# EasyEDA Pro project ProProject_Tautek_nRF5340_2024-01-15.epro

# Schematic Schematic1
Create Date: 2023-10-27; Page Name: P1; Project Name: Tautek_nRF5340; Schematic Name: Schematic1; Update Date: 2023-12-15; Drawed: Stephen Long Jr; Page Size: A4; Part Number: XIAO833_001; Version: V1.0
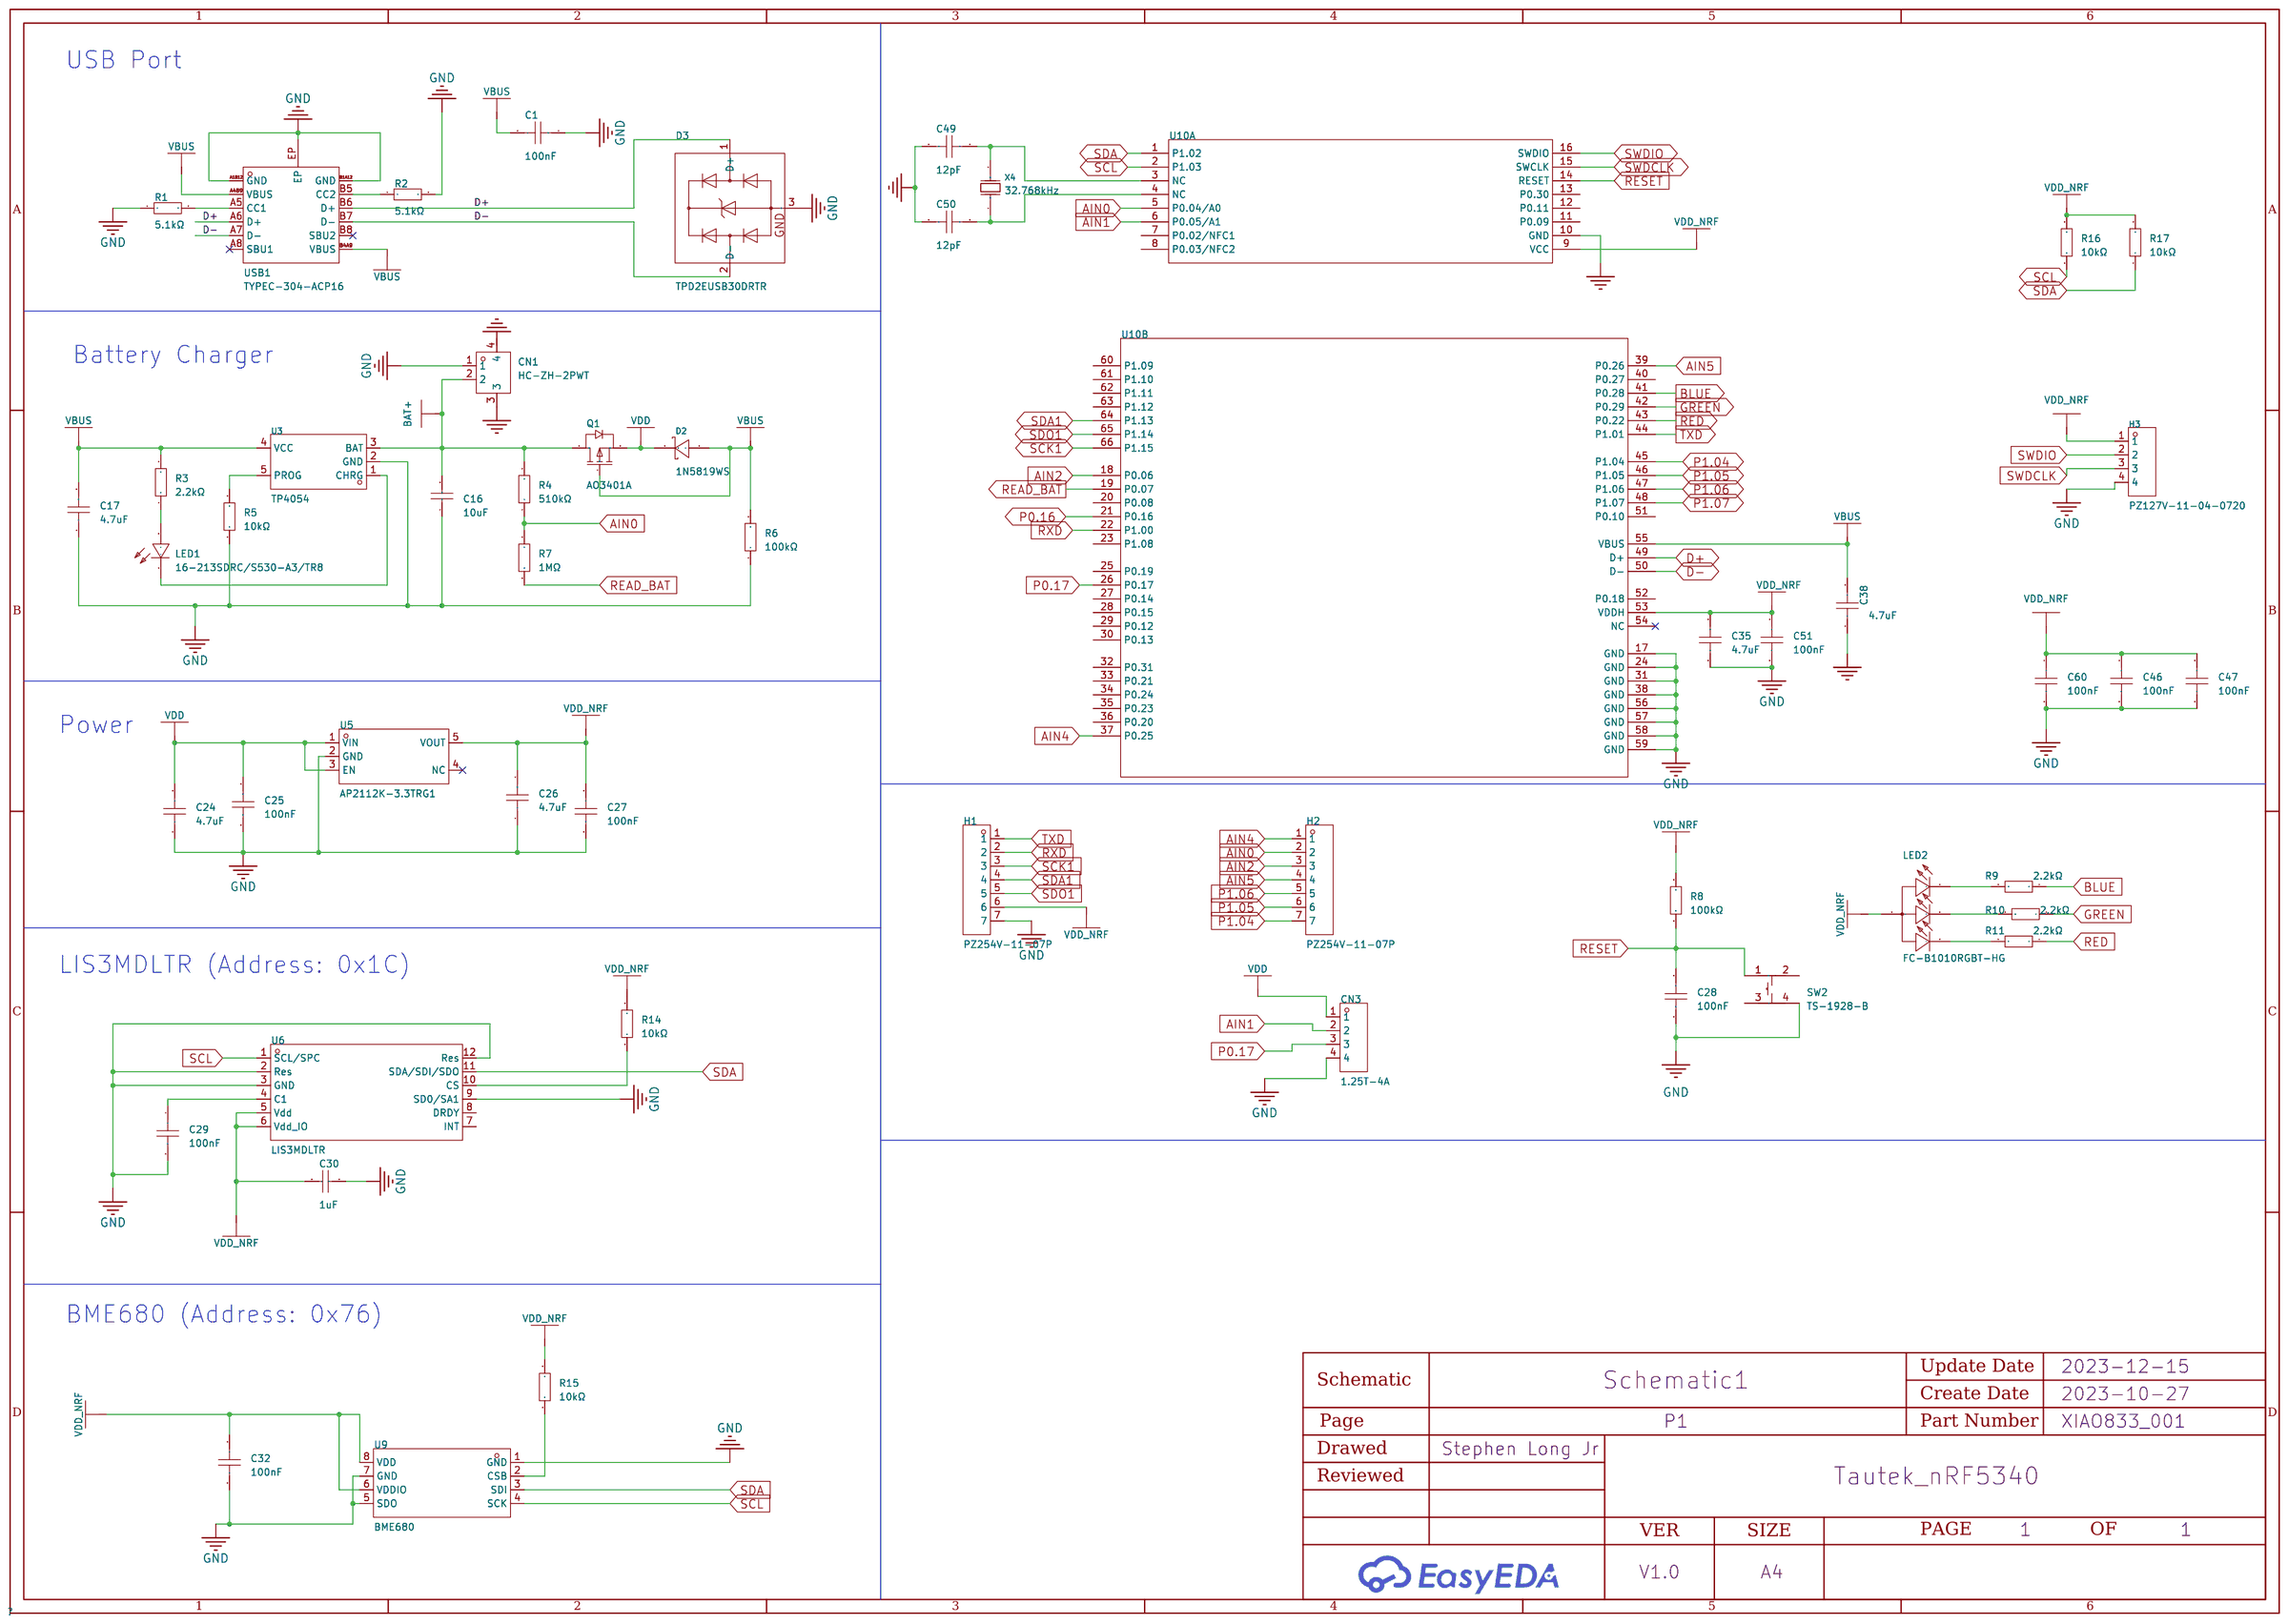
[diagram p0: schematic sheet]

## Parts
C1  100nF  [C0201]
C16  10uF  [C0402]
C17  4.7uF  [C0201]
C24  4.7uF  [C0201]
C25  100nF  [C0201]
C26  4.7uF  [C0201]
C27  100nF  [C0201]
C28  100nF  [C0201]
C29  100nF  [C0201]
C30  1uF  [C0201]
C32  100nF  [C0201]
C35  4.7uF  [C0201]
C38  4.7uF  [C0201]
C46  100nF  [C0201]
C47  100nF  [C0201]
C49  12pF  [C0201]
C50  12pF  [C0201]
C51  100nF  [C0201]
C60  100nF  [C0201]
CN1  HC-ZH-2PWT  [CONN-SMD_2P-P1.50_HCTL_HC-ZH-2PWT]
CN3  1.25T-4A  [CONN-TH_11.25T-4A]
D2  1N5819WS  [SOD-323_L1.8-W1.3-LS2.5-RD]
D3  TPD2EUSB30DRTR  [SOT-9X3-3_L1.0-W0.8-P0.35-LS1.0-BR]
H1  PZ254V-11-07P  [HDR-TH_7P-P2.54-V-M]  (no BOM)
H2  PZ254V-11-07P  [HDR-TH_7P-P2.54-V-M]  (no BOM)
H3  PZ127V-11-04-0720  [HDR-TH_4P-P1.27-V-M]  (no BOM)
LED1  16-213SDRC/S530-A3/TR8  [LED0402-RD]
LED2  FC-B1010RGBT-HG  [LED-ARRAY-SMD_4P-L1.0-W1.0-TR-RD]
Q1  AO3401A  [SOT-23_L2.9-W1.3-P1.90-LS2.4-BR]
R1  5.1kΩ  [R0201]
R2  5.1kΩ  [R0201]
R3  2.2kΩ  [R0201]
R4  510kΩ  [R0201]
R5  10kΩ  [R0201]
R6  100kΩ  [R0201]
R7  1MΩ  [R0201]
R8  100kΩ  [R0201]
R9  2.2kΩ  [R0201]
R10  2.2kΩ  [R0201]
R11  2.2kΩ  [R0201]
R14  10kΩ  [R0201]
R15  10kΩ  [R0201]
R16  10kΩ  [R0201]
R17  10kΩ  [R0201]
SW2  TS-1928-B  [KEY-SMD_4P-L2.8-W2.0-P1.20-LS3.0-TL]
U3  TP4054  [TSOT-23-5_L2.9-W1.6-P0.95-LS2.8-BR]
U5  AP2112K-3.3TRG1  [SOT-25-5_L2.9-W1.6-P0.95-LS2.8-BL]
U6  LIS3MDLTR  [LGA-12_L2.0-W2.0-P0.50-BL]
U9  BME680  [LGA-8_L3.0-W3.0-P0.80-TR]
U10  -  [BT40]  (sections 1,2)
USB1  TYPEC-304-ACP16  [USB-C-SMD_TYPE-C-16P-1]
X4  32.768kHz  [CRYSTAL-SMD_L1.7-W1.1]

## Library data of the parts
C1 C25 C27-C29 C32 C46 C47 C60 = CL03A104KQ3NNNC: Capacitance:Tolerance:±10%Tolerance:±10%VoltageRated:TemperatureCoefficient:; LCSC Part Name: 100nF±10%6.3V; Supplier Part: C160831; Manufacturer: SAMSUNG(三星); Supplier Footprint: 0201; JLCPCB Part Class: ExtendedPart; Datasheet: https://atta.szlcsc.com/upload/public/pdf/source/20171228/C160831_15144412250661213800.pdf; Supplier: LCSC; Tolerance: ±10%
C16 = CL05A106MQ5NUNC: Capacitance:Tolerance:±20%Tolerance:±20%VoltageRated:TemperatureCoefficient:; LCSC Part Name: 10uF±20%6.3V; Supplier Part: C15525; Manufacturer: SAMSUNG(三星); Supplier Footprint: 0402; JLCPCB Part Class: BasicPart; Datasheet: https://atta.szlcsc.com/upload/public/pdf/source/20220823/2B02EE04F8F211D38A52DCB16EB6BEBA.pdf; Supplier: LCSC; Tolerance: ±20%
C17 C24 C26 = GRM035R60J475ME15D: Capacitance:Tolerance:±20%Tolerance:±20%VoltageRated:TemperatureCoefficient:; LCSC Part Name: 4.7uF±20%6.3V; Supplier Part: C335103; Manufacturer: muRata(村田); Supplier Footprint: 0201; JLCPCB Part Class: ExtendedPart; Datasheet: https://atta.szlcsc.com/upload/public/pdf/source/20181123/C335103_65BC12EC0C1BBB7D605A3646AEC2CDDD.pdf; Supplier: LCSC; Tolerance: ±20%
C30 = GRM033R60J105KEA2D: Capacitance:Tolerance:±10%Tolerance:±10%VoltageRated:TemperatureCoefficient:; LCSC Part Name: 1uF±10%6.3V; Supplier Part: C76929; Manufacturer: muRata(村田); Supplier Footprint: 0201; JLCPCB Part Class: ExtendedPart; Datasheet: https://atta.szlcsc.com/upload/public/pdf/source/20161024/1477279478095.pdf; Supplier: LCSC; Tolerance: ±10%
C35 C38 = GRM035R60J475ME15D: Capacitance: Tolerance:±20% Tolerance:±20% Voltage Rated: Temperature Coefficient:; LCSC Part Name: 4.7uF ±20% 6.3V; Supplier Part: C335103; Manufacturer: muRata(村田); Supplier Footprint: 0201; JLCPCB Part Class: Extended Part; Datasheet: https://atta.szlcsc.com/upload/public/pdf/source/20181123/C335103_65BC12EC0C1BBB7D605A3646AEC2CDDD.pdf; Supplier: LCSC; Tolerance: ±20%
C49 C50 = GRM0335C1H120FA01D: Capacitance: Tolerance:±1% Tolerance:±1% Voltage Rated: Temperature Coefficient:; LCSC Part Name: 12pF ±1% 50V; Supplier Part: C384960; Manufacturer: muRata(村田); Supplier Footprint: 0201; JLCPCB Part Class: Extended Part; Datasheet: https://atta.szlcsc.com/upload/public/pdf/source/20200724/C384960_E35DB75AD6D4B3E668DE68A9F604D08E.pdf; Supplier: LCSC; Tolerance: ±1%
C51 = CL03A104KQ3NNNC: Capacitance: Tolerance:±10% Tolerance:±10% Voltage Rated: Temperature Coefficient:; LCSC Part Name: 100nF ±10% 6.3V; Supplier Part: C160831; Manufacturer: SAMSUNG(三星); Supplier Footprint: 0201; JLCPCB Part Class: Extended Part; Datasheet: https://atta.szlcsc.com/upload/public/pdf/source/20171228/C160831_15144412250661213800.pdf; Supplier: LCSC; Tolerance: ±10%
CN1 = HC-ZH-2PWT: ReferenceSeries:-Pitch:1.5mmPinsStructure:1x2PNumberofRows:1NumberofPINsPerRow:2RowSpacing:-Gender:公型插针MountingStyle:SurfaceMountCurrentRating(Max):2AOperatingTemperatureRange:-25℃~+85℃OperatingTemperatureRange:-25℃~+85℃; LCSC Part Name: 2P卧贴间距P=1.5mm; Supplier Part: C2845424; Manufacturer: HCTL(华灿天禄); Supplier Footprint: SMD,P=1.5mm; JLCPCB Part Class: ExtendedPart; Datasheet: https://atta.szlcsc.com/upload/public/pdf/source/20210728/C2845424_7B6E44CFC3278823D52F35075130A26B.pdf; Supplier: LCSC; Pitch: 1.5mm; Pins Structure: 1x2P; Number of Rows: 1; Number of PINs Per Row: 2; Gender: 公型插针; Mounting Style: SurfaceMount; Current Rating (Max): 2A; Operating Temperature Range: -25℃~+85℃
CN3 = 1.25T-4A_C722638: ReferenceSeries:-Pitch:1.25mmPinsStructure:1x4PNumberofRows:1NumberofPINsPerRow:4RowSpacing:-Gender:公型插针MountingStyle:StraightCurrentRating(Max):1AOperatingTemperatureRange:-25℃~+85℃OperatingTemperatureRange:-25℃~+85℃; LCSC Part Name: 1.25mm1x4P直插; Supplier Part: C722638; Manufacturer: CAX(创都); Supplier Footprint: 直插,P=1.25mm; JLCPCB Part Class: ExtendedPart; Datasheet: https://atta.szlcsc.com/upload/public/pdf/source/20200831/C722633_AFE288A1881D4EC7ACD8329A0E24959E.pdf; Supplier: LCSC; Pitch: 1.25mm; Pins Structure: 1x4P; Number of Rows: 1; Number of PINs Per Row: 4; Gender: 公型插针; Mounting Style: Straight; Current Rating (Max): 1A; Operating Temperature Range: -25℃~+85℃
D2 = 1N5819WS_C191023: ReverseVoltage(Vr):40VAverageRectifiedCurrent(Io):1AForwardVoltage(Vf@If):600mV@1A; LCSC Part Name: 40V1A600mV@1A; Supplier Part: C191023; Manufacturer: Hottech(合科泰); Supplier Footprint: SOD-323; JLCPCB Part Class: BasicPart; Datasheet: https://atta.szlcsc.com/upload/public/pdf/source/20220428/3CB86FD8D28D653594B4E35F9D5AEFD9.pdf; Supplier: LCSC; Reverse Voltage (Vr): 40V; Average Rectified Current (Io): 1A; Forward Voltage (Vf@If): 600mV@1A
D3 = TPD2EUSB30DRTR: Polarity:UnidirectionalReverseStand-OffVoltage(Vrwm):5.5VBreakdownVoltage(VBR):7VPeakPulseCurrent(Ipp)@8/20us:1AClampingVoltage@Ipp:8VPeakPulsePower(Ppp)@8/20us:45WJunctionCapacitance(Cj)@1MHz:-OperatingTemperature:-40℃~+85℃@(Ta)Operat; Supplier Part: C97502; Manufacturer: TI(德州仪器); Supplier Footprint: SOT(9x3); JLCPCB Part Class: ExtendedPart; Datasheet: https://atta.szlcsc.com/upload/public/pdf/source/20180606/C97502_7D6B9DA0047678414AA5A2CAF7AAB465.pdf; Supplier: LCSC; Polarity: Unidirectional; Reverse Stand-Off Voltage (Vrwm): 5.5V; Breakdown Voltage (VBR): 7V; Peak Pulse Current(Ipp)@8/20us: 1A; Clamping Voltage@Ipp: 8V; Peak Pulse Power(Ppp)@8/20us: 45W; Operating Temperature: -40℃~+85℃@(Ta)
H1 H2 = PZ254V-11-07P: NumberofRows:PluginNumberofPins:7PPitch:2.54mmPinStructure:1x7PRowSpacing:-MountingType:StraightCircluarPins/SquarePins:SquarePinsCurrentRating(Max):-VoltageRating(Max):-LengthofMatingPin:6mmInsulationHeight:2.5mmLengthofEnd; LCSC Part Name: 2.54mm1x7P直插方针; Supplier Part: C492406; Manufacturer: XFCN(兴飞); Supplier Footprint: 插件,P=2.54mm; JLCPCB Part Class: ExtendedPart; Datasheet: https://atta.szlcsc.com/upload/public/pdf/source/20200309/C492406_654C533EE691117E22DD9F76C114C2D9.pdf; Supplier: LCSC; Number of Rows: Plugin; Number of Pins: 7P; Pitch: 2.54mm; Pin Structure: 1x7P; Mounting Type: Straight; Circluar Pins/Square Pins: SquarePins; Length of Mating Pin: 6mm; Insulation Height: 2.5mm; Length of End Connection Pin: 3mm; Operating Temperature Range: -40℃~+105℃; Color: Black
H3 = PZ127V-11-04-0720: NumberofRows:PluginNumberofPins:4PPitch:1.27mmPinStructure:1x4PRowSpacing:-MountingType:StraightCircluarPins/SquarePins:-CurrentRating(Max):-VoltageRating(Max):-LengthofMatingPin:3.9mmInsulationHeight:1mmLengthofEndConnectio; LCSC Part Name: 1.27mm1x4P直插; Supplier Part: C541879; Manufacturer: XFCN(兴飞); Supplier Footprint: 插件,P=1.27mm; JLCPCB Part Class: ExtendedPart; Datasheet: https://atta.szlcsc.com/upload/public/pdf/source/20200519/C541879_5CD99C402ABEE613587AE88FBA356357.pdf; Supplier: LCSC; Number of Rows: Plugin; Number of Pins: 4P; Pitch: 1.27mm; Pin Structure: 1x4P; Mounting Type: Straight; Length of Mating Pin: 3.9mm; Insulation Height: 1mm; Length of End Connection Pin: 2.3mm; Operating Temperature Range: -40℃~+105℃; Color: Black
LED1 = 16-213SDRC/S530-A3/TR8: EmittedColor:红灯LensColor:无色透明DominantWavelength:639nm~639nmDominantWavelength:639nm~639nmPeakWavelength:650nmForwardCurrent:20mAForwardVoltage(VF):2VForwardVoltage(VF):2VViewingAngle:120°; LCSC Part Name: 红灯; Supplier Part: C71911; Manufacturer: EVERLIGHT(亿光); Supplier Footprint: 0402; JLCPCB Part Class: ExtendedPart; Datasheet: https://atta.szlcsc.com/upload/public/pdf/source/20180423/C71911_C51F85E8EEDEC443F292EE02E8E26750.pdf; Supplier: LCSC; Emitted Color: 红灯; Lens Color: 无色透明; Dominant Wavelength: 639nm~639nm; Peak Wavelength: 650nm; Forward Current: 20mA; Forward Voltage (VF): 2V; Viewing Angle: 120°
LED2 = FC-B1010RGBT-HG: EmittedColor:RGB; LCSC Part Name: RGB三色; Supplier Part: C158099; Manufacturer: 国星光电; Supplier Footprint: 0404; JLCPCB Part Class: ExtendedPart; Datasheet: https://atta.szlcsc.com/upload/public/pdf/source/20200910/C158099_0C805F16310A4C6DB0163E8F613FF382.pdf; Supplier: LCSC; Emitted Color: RGB
Q1 = AO3401A_C347476: Supplier Part: C347476; Manufacturer: UMW(广东友台半导体); Supplier Footprint: SOT-23; JLCPCB Part Class: ExtendedPart; Datasheet: https://atta.szlcsc.com/upload/public/pdf/source/20190827/C347476_6CCC01FEC3E3D166C83BA0E415FD2056.pdf; Supplier: LCSC
R1 R2 = RC0201FR-075K1L: Type:ThickFilmResistorsResistance:Tolerance:±1%Tolerance:±1%Power(Watts):TemperatureCoefficient:±200ppm/℃TemperatureCoefficient:±200ppm/℃OverloadVoltage(Max):OperatingTemperatureRange:-55℃~+125℃OperatingTemperatureRange:-55℃~+125℃; LCSC Part Name: 厚膜电阻5.1kΩ±1%50mW; Supplier Part: C274341; Manufacturer: YAGEO(国巨); Supplier Footprint: 0201; JLCPCB Part Class: ExtendedPart; Datasheet: https://atta.szlcsc.com/upload/public/pdf/source/20180821/C275644_0D56F95EFF785E7D9A1FEF436B37DA78.pdf; Supplier: LCSC; Type: ThickFilmResistors; Tolerance: ±1%; Temperature Coefficient: ±200ppm/℃; Operating Temperature Range: -55℃~+125℃
R3 R9-R11 = RC0201FR-072K2L: Type:ThickFilmResistorsResistance:Tolerance:±1%Tolerance:±1%Power(Watts):TemperatureCoefficient:±200ppm/℃TemperatureCoefficient:±200ppm/℃OverloadVoltage(Max):OperatingTemperatureRange:-55℃~+125℃OperatingTemperatureRange:-55℃~+125℃; LCSC Part Name: 2.2kΩ±1%50mW; Supplier Part: C142018; Manufacturer: YAGEO(国巨); Supplier Footprint: 0201; JLCPCB Part Class: ExtendedPart; Datasheet: https://atta.szlcsc.com/upload/public/pdf/source/20171113/C142018_15105613515531115845.pdf; Supplier: LCSC; Type: ThickFilmResistors; Tolerance: ±1%; Temperature Coefficient: ±200ppm/℃; Operating Temperature Range: -55℃~+125℃
R4 = RC0201FR-07510KL: Type:ThickFilmResistorsResistance:Tolerance:±1%Tolerance:±1%Power(Watts):TemperatureCoefficient:±200ppm/℃TemperatureCoefficient:±200ppm/℃OverloadVoltage(Max):OperatingTemperatureRange:-55℃~+125℃OperatingTemperatureRange:-55℃~+125℃; LCSC Part Name: 510kΩ±1%50mW; Supplier Part: C295805; Manufacturer: YAGEO(国巨); Supplier Footprint: 0201; JLCPCB Part Class: ExtendedPart; Datasheet: https://atta.szlcsc.com/upload/public/pdf/source/20180921/C295805_AC1D158A755474E826FD01D881AA929B.pdf; Supplier: LCSC; Type: ThickFilmResistors; Tolerance: ±1%; Temperature Coefficient: ±200ppm/℃; Operating Temperature Range: -55℃~+125℃
R5 R14-R17 = RC0201FR-0710KL: Type:ThickFilmResistorsResistance:Tolerance:±1%Tolerance:±1%Power(Watts):TemperatureCoefficient:±200ppm/℃TemperatureCoefficient:±200ppm/℃OverloadVoltage(Max):OperatingTemperatureRange:-55℃~+125℃OperatingTemperatureRange:-55℃~+125℃; LCSC Part Name: 10kΩ±1%50mW; Supplier Part: C106225; Manufacturer: YAGEO(国巨); Supplier Footprint: 0201; JLCPCB Part Class: ExtendedPart; Datasheet: https://atta.szlcsc.com/upload/public/pdf/source/20171221/C106225_15138309973201195185.pdf; Supplier: LCSC; Type: ThickFilmResistors; Tolerance: ±1%; Temperature Coefficient: ±200ppm/℃; Operating Temperature Range: -55℃~+125℃
R6 R8 = RC0201FR-07100KL: Resistance:Tolerance:±1%Tolerance:±1%Power(Watts):TemperatureCoefficient:±200ppm/℃TemperatureCoefficient:±200ppm/℃OverloadVoltage(Max):OperatingTemperatureRange:-55℃~+125℃OperatingTemperatureRange:-55℃~+125℃; LCSC Part Name: 100kΩ±1%50mW; Supplier Part: C106224; Manufacturer: YAGEO(国巨); Supplier Footprint: 0201; JLCPCB Part Class: ExtendedPart; Datasheet: https://atta.szlcsc.com/upload/public/pdf/source/20171221/C106224_15138309965451195184.pdf; Supplier: LCSC; Tolerance: ±1%; Temperature Coefficient: ±200ppm/℃; Operating Temperature Range: -55℃~+125℃
R7 = RC0201FR-071ML: Type:ThickFilmResistorsResistance:Tolerance:±1%Tolerance:±1%Power(Watts):TemperatureCoefficient:±200ppm/℃TemperatureCoefficient:±200ppm/℃OverloadVoltage(Max):OperatingTemperatureRange:-55℃~+125℃OperatingTemperatureRange:-55℃~+125℃; LCSC Part Name: 1MΩ±1%50mW; Supplier Part: C295786; Manufacturer: YAGEO(国巨); Supplier Footprint: 0201; JLCPCB Part Class: ExtendedPart; Datasheet: https://atta.szlcsc.com/upload/public/pdf/source/20180921/C295786_3F2C1EC02A5F9891A7C118DD4066AFE1.pdf; Supplier: LCSC; Type: ThickFilmResistors; Tolerance: ±1%; Temperature Coefficient: ±200ppm/℃; Operating Temperature Range: -55℃~+125℃
SW2 = TS-1928-B: ContactCurrent:50mAVoltageRating(DC):12VInsulationResistance:-Circuit:SPSTMountingStyle:BricknoggingActuatorStyle:RoundButtonActuator/CapColor:BlackWithLamp:NoOperatingForce:160gfMechanicalLife:300000次OperatingTemperature:-30℃~+85℃; LCSC Part Name: 立贴1.95*2.8*0.6mm轻触开关; Supplier Part: C1121891; Manufacturer: XKBConnectivity(中国星坤); Supplier Footprint: SMD; JLCPCB Part Class: ExtendedPart; Datasheet: https://atta.szlcsc.com/upload/public/pdf/source/20211011/D4E0D57631292A8298BD84F341C06C74.pdf; Supplier: LCSC; Contact Current: 50mA; Voltage Rating (DC): 12V; Circuit: SPST; Mounting Style: Bricknogging; Actuator Style: RoundButton; Actuator/Cap Color: Black; With Lamp: No; Operating Force: 160gf; Mechanical Life: 300000次; Operating Temperature: -30℃~+85℃; Switch Length: 1.95mm; Switch Width: 2.8mm; Switch Height: 0.6mm; Strike Gundam: NO
U3 = TP4054_C668215: TypeofBattery:锂离子/PolymerNumberofCells:1NumberofCells:1MaximumChargeCurrent:500mASupplyVoltage:6.5VSupplyVoltage:6.5VOperatingTemperature:-40℃~+85℃OperatingTemperature:-40℃~+85℃; Supplier Part: C668215; Manufacturer: UMW(友台半导体); Supplier Footprint: SOT-23-5; JLCPCB Part Class: ExtendedPart; Datasheet: https://atta.szlcsc.com/upload/public/pdf/source/20211011/DD9DB39E30D67DDF115F79B4376A27FF.pdf; Supplier: LCSC; Type of Battery: 锂离子/Polymer; Number of Cells: 1; Maximum Charge Current: 500mA; Supply Voltage: 6.5V; Operating Temperature: -40℃~+85℃
U5 = AP2112K-3.3TRG1: OutputType:OutputPolarity:PositiveNumberofOutputs:1MaximumInputVoltage:6VOutputVoltage:3.3V~3.3VOutputVoltage:3.3V~3.3VDropoutVoltage:400mV@(600mA)OutputCurrent:600mAPowerSupplyRejectionRatio(PSRR):65dB@(100Hz,1kHz); Supplier Part: C51118; Manufacturer: DIODES(美台); Supplier Footprint: SOT-25-5; JLCPCB Part Class: ExtendedPart; Datasheet: https://atta.szlcsc.com/upload/public/pdf/source/20171221/C51118_15138312998391195590.pdf; Supplier: LCSC; Output Polarity: Positive; Number of Outputs: 1; Maximum Input Voltage: 6V; Output Voltage: 3.3V~3.3V; Dropout Voltage: 400mV@(600mA); Output Current: 600mA; Power Supply Rejection Ratio (PSRR): 65dB@(100Hz,1kHz)
U6 = LIS3MDLTR: LCSC Part Name: 三轴数字磁传感器; Supplier Part: C478483; Manufacturer: ST(意法半导体); Supplier Footprint: LGA-12; JLCPCB Part Class: ExtendedPart; Supplier: LCSC
U9 = BME680: Supplier Part: C125972; Manufacturer: Bosch(博世); Supplier Footprint: LGA-8; JLCPCB Part Class: ExtendedPart; Datasheet: https://atta.szlcsc.com/upload/public/pdf/source/20180327/C125972_A896D04D1D4DD1EE7894A8064AE337BE.pdf; Supplier: LCSC
U10 = BT40E
USB1 = TYPEC-304-ACP16: ConnectorType:Type-CGender:FemaleNumberofContacts:16NumberofPorts:1MountingStyle:SurfaceMountCurrentRating-Power(Max):3AOperatingTemperatureRange:-40℃~+85℃OperatingTemperatureRange:-40℃~+85℃; LCSC Part Name: Type-C母座卧贴; Supplier Part: C2982555; Manufacturer: XUNPU(讯普); Supplier Footprint: SMD; JLCPCB Part Class: ExtendedPart; Supplier: LCSC; Connector Type: Type-C; Gender: Female; Number of Contacts: 16; Number of Ports: 1; Mounting Style: SurfaceMount; Current Rating - Power (Max): 3A; Operating Temperature Range: -40℃~+85℃
X4 = X1A000121000500: Frequency: Frequency Tolerance:- Frequency Tolerance:- Load Capacitance:; LCSC Part Name: 32.768kHz 12.5pF; Supplier Part: C5154201; Manufacturer: EPSON(爱普生); Supplier Footprint: SMD1610-2P; JLCPCB Part Class: Extended Part; Supplier: LCSC

## Nets
GND: C1.1 C16.1 C17.1 C24.1 C25.2 C26.1 C27.2 C28.1 C29.2 C30.2 C32.1 C35.1 C38.1 C46.2 C47.2 C49.1 C50.1 C51.2 C60.2 CN1.1 CN1.3 CN3.4 D3.3(GND) H1.7 H3.4 R1.1 R2.2 R5.1 R6.1 SW2.4 U3.2(GND) U5.2(GND) U6.2(Res) U6.3(GND) U6.9(SD0/SA1) U6.12(Res) U9.1(GND) U9.5(SDO) U9.7(GND) U10.10(GND) U10.17(GND) U10.24(GND) U10.31(GND) U10.38(GND) U10.56(GND) U10.57(GND) U10.58(GND) U10.59(GND) USB1.A1B12(GND) USB1.B1A12(GND) USB1.EP
VBUS: C1.2 C17.2 C38.2 D2.2(A) Q1.1(G) R3.2 R6.2 U3.4(VCC) U10.55(VBUS) USB1.A4B9(VBUS) USB1.B4A9(VBUS)
VDD: C24.2 C25.1 CN3.1 D2.1(K) Q1.2(S) U5.1(VIN) U5.3(EN)
VDD_NRF: C26.2 C27.1 C30.1 C32.2 C35.2 C46.1 C47.1 C51.1 C60.1 H1.6 H3.1 LED2.1(+) R8.2 R14.2 R15.2 R16.2 R17.2 U5.5(VOUT) U6.5(Vdd) U6.6(Vdd_IO) U9.6(VDDIO) U9.8(VDD) U10.9(VCC) U10.53(VDDH)
AIN0: H2.2 R4.1 R7.1 U10.5(P0.04/A0)
AIN1: CN3.2 U10.6(P0.05/A1)
AIN2: H2.3 U10.18(P0.06)
AIN4: H2.1 U10.37(P0.25)
AIN5: H2.4 U10.39(P0.26)
BAT+: C16.2 CN1.2 Q1.3(D) R4.2 U3.3(BAT)
BLUE: R9.1 U10.41(P0.28)
D+: D3.1(D+) U10.49(D+) USB1.A6(D+) USB1.B6(D+)
D-: D3.2(D-) U10.50(D-) USB1.A7(D-) USB1.B7(D-)
GREEN: R10.1 U10.42(P0.29)
P0.16: U10.21(P0.16)
P0.17: CN3.3 U10.26(P0.17)
P1.04: H2.7 U10.45(P1.04)
P1.05: H2.6 U10.46(P1.05)
P1.06: H2.5 U10.47(P1.06)
P1.07: U10.48(P1.07)
READ_BAT: R7.2 U10.19(P0.07)
RED: R11.1 U10.43(P0.22)
RESET: C28.2 R8.1 SW2.1 U10.14(RESET)
RXD: H1.2 U10.22(P1.00)
SCK1: H1.3 U10.66(P1.15)
SCL: R16.1 U6.1(SCL/SPC) U9.4(SCK) U10.2(P1.03)
SDA: R17.1 U6.11(SDA/SDI/SDO) U9.3(SDI) U10.1(P1.02)
SDA1: H1.4 U10.64(P1.13)
SDO1: H1.5 U10.65(P1.14)
SWDCLK: H3.3 U10.15(SWCLK)
SWDIO: H3.2 U10.16(SWDIO)
TXD: H1.1 U10.44(P1.01)
$1N6010: R1.2 USB1.A5(CC1)
$1N6013: R2.1 USB1.B5(CC2)
$1N6476: R5.2 U3.5(PROG)
$1N7177: R14.1 U6.10(CS)
$1N7737: C29.1 U6.4(C1)
$1N8157: R15.1 U9.2(CSB)
$1N9194: LED2.4(-) R9.2
$1N9197: LED2.3(-) R10.2
$1N9200: LED2.2(-) R11.2
$1N15220: LED1.2(+) R3.1
$1N15223: LED1.1(-) U3.1(CHRG)
$1N50577: C49.2 U10.3(NC) X4.2(OSC2)
$1N50578: C50.2 U10.4(NC) X4.1(OSC1)

Not connected (* = marked no-connect by the designer): CN1 4; SW2 2 3; U5 4(NC)*; U6 7(INT) 8(DRDY); U10 7(P0.02/NFC1) 8(P0.03/NFC2) 11(P0.09) 12(P0.11) 13(P0.30) 20(P0.08) 23(P1.08) 25(P0.19) 27(P0.14) 28(P0.15) 29(P0.12) 30(P0.13) 32(P0.31) 33(P0.21) 34(P0.24) 35(P0.23) 36(P0.20) 40(P0.27) 51(P0.10) 52(P0.18) 54(NC)* 60(P1.09) 61(P1.10) 62(P1.11) 63(P1.12); USB1 A8(SBU1)* B8(SBU2)*

## Notes on the sheet
- USB Port
- Battery Charger
- Power
- LIS3MDLTR (Address: 0x1C)
- BME680 (Address: 0x76)

# Board PCB1
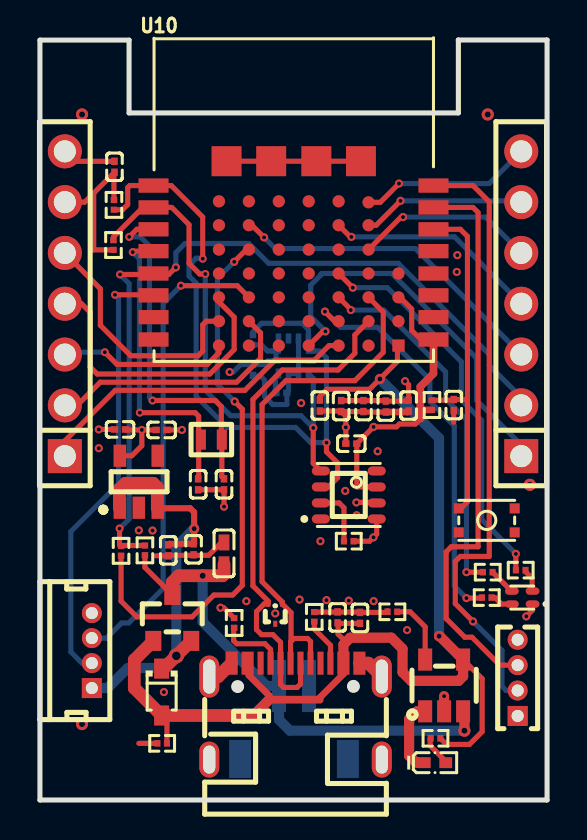
[diagram p1: board, top side]
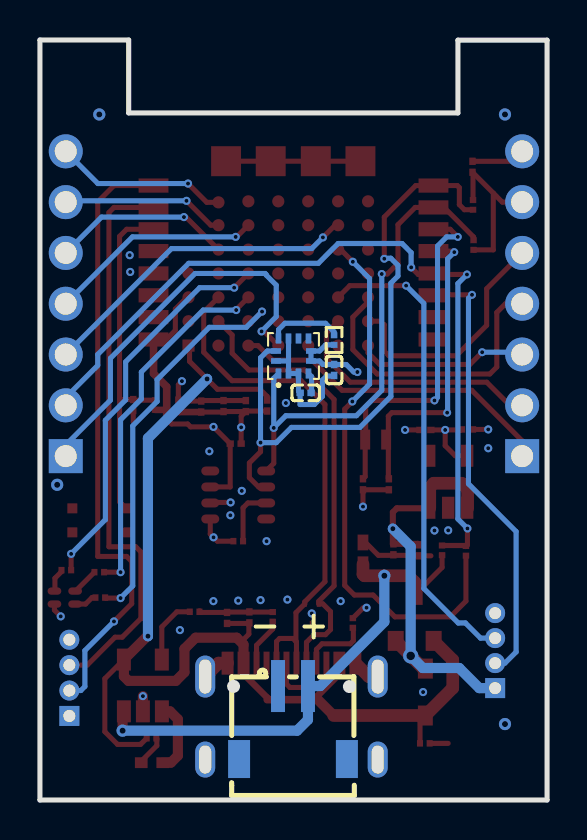
[diagram p2: board, bottom side, seen from below]

Outline 25.4 x 38 mm; copper layers: Top Layer, Inner1, Inner2, Bottom Layer. Coordinates in mm from the lower left corner of the outline.
Outline path: 0,0 0,37.99 4.47,37.99 4.47,34.35 20.95,34.35 20.95,38 25.4,38 25.4,0 0,0
Stack: Top Layer 0.035mm / Dielectric1 0.48mm PP er 4.5 / Inner1 0.035mm / Dielectric2 0.48mm FR4 er 4.5 / Inner2 0.035mm / Dielectric3 0.48mm PP er 4.5 / Bottom Layer 0.035mm

## Design rules (mm)
net D-: DP1
net D+: DP1
template: Custom Config
spacing copperThickness1oz (default): track to track 0.102, other pairs 0.152 to 0.3
spacing copperThickness2oz: track to track 0.203, other pairs 0.152 to 0.3
track width copperThickness1oz (default): min 0.127, default 0.254, max 2.54
track width copperThickness2oz: min 0.203, default 0.254, max 2.54
differential pair differentialPair (default): width min 0.127, default 0.254, max 2.54; gap min 0.152, default 0.152
via viaSize (default): diameter min 0.399, default 0.61, max 10; hole min 0.201, default 0.305, max 6.299

## Placement (name value [footprint] x y rotation side)
C1  100nF  [C0201]  14.91 9.13 270 top
C16  10uF  [C0402]  9.22 12.33 270 top
C17  4.7uF  [C0201]  16.03 9.11 270 top
C24  4.7uF  [C0201]  6.43 12.48 90 top
C25  100nF  [C0201]  7.7 12.53 270 top
C26  4.7uF  [C0201]  4.01 18.53 0 top
C27  100nF  [C0201]  6.1 18.5 0 top
C28  100nF  [C0201]  20.73 19.75 90 top
C29  100nF  [C0201]  12.09 20.36 0 bottom
C30  1uF  [C0201]  10.67 21.5 270 bottom
C32  100nF  [C0201]  15.6 17.82 0 top
C35  4.7uF  [C0201]  15.09 19.7 90 top
C38  4.7uF  [C0201]  14.02 19.72 90 top
C46  100nF  [C0201]  16.2 19.7 270 top
C47  100nF  [C0201]  3.73 31.66 90 top
C49  12pF  [C0201]  9.22 15.79 90 top
C50  12pF  [C0201]  7.92 15.79 90 top
C51  100nF  [C0201]  17.32 19.67 270 top
C60  100nF  [C0201]  18.47 19.72 270 top
CN1  HC-ZH-2PWT  [CONN-SMD_2P-P1.50_HCTL_HC-ZH-2PWT]  12.73 3.87 180 bottom
CN3  1.25T-4A  [CONN-TH_11.25T-4A]  2.6 7.47 90 top
D2  1N5819WS  [SOD-323_L1.8-W1.3-LS2.5-RD]  6.1 5.4 270 top
D3  TPD2EUSB30DRTR  [SOT-9X3-3_L1.0-W0.8-P0.35-LS1.0-BR]  11.79 9.31 90 top
H1  PZ254V-11-07P  [HDR-TH_7P-P2.54-V-M]  1.25 24.81 90 top
H2  PZ254V-11-07P  [HDR-TH_7P-P2.54-V-M]  24.11 24.81 90 top
H3  PZ127V-11-04-0720  [HDR-TH_4P-P1.27-V-M]  23.93 6.11 90 top
LED1  16-213SDRC/S530-A3/TR8  [LED0402-RD]  19.79 1.87 0 top
LED2  FC-B1010RGBT-HG  [LED-ARRAY-SMD_4P-L1.0-W1.0-TR-RD]  24.16 10.12 270 top
Q1  AO3401A  [SOT-23_L2.9-W1.3-P1.90-LS2.4-BR]  6.63 9.11 270 top
R1  5.1kΩ  [R0201]  9.73 8.85 270 top
R2  5.1kΩ  [R0201]  13.74 9.16 90 top
R3  2.2kΩ  [R0201]  19.81 3.09 0 top
R4  510kΩ  [R0201]  5.26 12.48 270 top
R5  10kΩ  [R0201]  17.65 9.41 0 top
R6  100kΩ  [R0201]  6.12 2.83 0 top
R7  1MΩ  [R0201]  4.06 12.46 270 top
R8  100kΩ  [R0201]  19.63 19.75 270 top
R9  2.2kΩ  [R0201]  24.08 11.49 0 top
R10  2.2kΩ  [R0201]  22.43 11.39 0 top
R11  2.2kΩ  [R0201]  22.38 10.12 0 top
R14  10kΩ  [R0201]  10.67 23 270 bottom
R15  10kΩ  [R0201]  15.47 12.94 0 top
R16  10kΩ  [R0201]  3.68 27.75 270 top
R17  10kΩ  [R0201]  3.71 29.76 90 top
SW2  TS-1928-B  [KEY-SMD_4P-L2.8-W2.0-P1.20-LS3.0-TL]  22.38 13.98 0 top
U3  TP4054  [TSOT-23-5_L2.9-W1.6-P0.95-LS2.8-BR]  20.24 5.73 270 top
U5  AP2112K-3.3TRG1  [SOT-25-5_L2.9-W1.6-P0.95-LS2.8-BL]  4.95 15.91 0 top
U6  LIS3MDLTR  [LGA-12_L2.0-W2.0-P0.50-BL]  12.7 22.2 180 bottom
U9  BME680  [LGA-8_L3.0-W3.0-P0.80-TR]  15.47 15.25 180 top
U10  -  [BT40]  5.71 21.93 0 top
USB1  TYPEC-304-ACP16  [USB-C-SMD_TYPE-C-16P-1]  12.8 4.43 0 top
X4  32.768kHz  [CRYSTAL-SMD_L1.7-W1.1]  8.58 18.02 0 top

## Footprints (pads in the part's own frame, mm; a bottom-side part is the same pattern mirrored in y, then rotated)
BT40
  rect 1.498x0.711 smd: 1(-0.025,8.789) 2(-0.025,7.696) 3(-0.025,6.604) 4(-0.025,5.512) 5(-0.025,4.394) 6(-0.025,3.302) 7(-0.025,2.21) 8(-0.025,1.092) 9(13.995,1.092) 10(13.995,2.21) 11(13.995,3.302) 12(13.995,4.394) 13(13.995,5.512) 14(13.995,6.604) 15(13.995,7.696) 16(13.995,8.789)
  round 0.61 smd: 17(4.75,8.001) 18(4.75,6.807) 19(4.75,5.588) 20(4.75,4.394) 21(4.75,3.2) 22(4.75,2.006) 23(4.75,0.787) 24(6.248,8.001) 25(6.248,6.807) 26(6.248,5.588) 27(6.248,4.394) 28(6.248,3.2) 29(6.248,2.006) 30(6.248,0.787) 31(7.747,8.001) 32(7.747,6.807) 33(7.747,5.588) 34(7.747,4.394) 35(7.747,3.2) 36(7.747,2.006) 37(7.747,0.787) 38(9.245,8.001) 39(9.245,6.807) 40(9.245,5.588) 41(9.245,4.394) 42(9.245,3.2) 43(9.245,2.006) 44(9.245,0.787) 45(10.744,7.95) 46(10.744,6.807) 47(10.744,5.588) 48(10.744,4.394) 49(10.744,3.2) 50(10.744,2.006) 51(10.744,0.787) 52(12.243,4.394) 53(12.243,3.2) 54(12.243,2.006) 60(3.251,8.001) 61(3.251,6.807) 62(3.251,5.588) 63(3.251,4.394) 64(3.251,3.2) 65(3.251,2.006) 66(3.251,0.787)
  rect 0.61x0.61 smd: 55(12.243,0.787)
  rect 1.498x1.498 smd: 56(3.632,10.008) 57(5.867,10.008) 58(8.128,10.008) 59(10.363,10.008)
C0201
  rect 0.368x0.324 smd: 1(-0.275,0) 2(0.275,0)
C0402
  rect 0.79x0.54 smd: 1(-0.545,0) 2(0.545,0)
CONN-SMD_2P-P1.50_HCTL_HC-ZH-2PWT
  rect 0.7x2.6 smd: 1(-0.75,1.825) 2(0.75,1.825)
  rect 1.1x1.9 smd: 3(2.7,-1.825) 4(-2.7,-1.825)
CONN-TH_11.25T-4A
  rect 1x1 hole 0.6: 1(-1.875,0)
  round 1 hole 0.6: 2(-0.625,0) 3(0.625,0) 4(1.875,0)
CRYSTAL-SMD_L1.7-W1.1
  rect 0.5x1 smd: 1(-0.525,0) 2(0.525,0)
HDR-TH_4P-P1.27-V-M
  rect 1x1 hole 0.6: 1(-1.905,0)
  round 1 hole 0.6: 2(-0.635,0) 3(0.635,0) 4(1.905,0)
HDR-TH_7P-P2.54-V-M
  rect 1.7x1.7 hole 1.1: 1(-7.62,0)
  round 1.7 hole 1.1: 2(-5.08,0) 3(-2.54,0) 4(0,0) 5(2.54,0) 6(5.08,0) 7(7.62,0)
KEY-SMD_4P-L2.8-W2.0-P1.20-LS3.0-TL
  rect 0.5x0.5 smd: 1(-1.4,0.6) 2(1.4,0.6) 3(-1.4,-0.6) 4(1.4,-0.6)
LED0402-RD
  rect 0.636x0.54 smd: 1(-0.538,0) 2(0.538,0)
LED-ARRAY-SMD_4P-L1.0-W1.0-TR-RD
  oval 0.364x0.687 smd: 1(0.325,0.518) 2(0.325,-0.518) 3(-0.325,-0.518) 4(-0.325,0.518)
LGA-8_L3.0-W3.0-P0.80-TR
  oval 0.9x0.448 smd: 1(1.4,1.2) 2(1.4,0.4) 3(1.4,-0.4) 4(1.4,-1.2) 5(-1.4,-1.2) 6(-1.4,-0.4) 7(-1.4,0.4) 8(-1.4,1.2)
LGA-12_L2.0-W2.0-P0.50-BL
  rect 0.28x0.5 smd: 1(-0.75,-0.875) 2(-0.25,-0.875) 3(0.25,-0.875) 4(0.75,-0.875) 7(0.75,0.875) 8(0.25,0.875) 9(-0.25,0.875) 10(-0.75,0.875)
  rect 0.5x0.28 smd: 5(0.875,-0.25) 6(0.875,0.25) 11(-0.875,0.25) 12(-0.875,-0.25)
R0201
  rect 0.303x0.324 smd: 1(-0.241,0) 2(0.241,0)
SOD-323_L1.8-W1.3-LS2.5-RD
  rect 1x0.75 smd: 1(-1.173,0) 2(1.173,0)
SOT-9X3-3_L1.0-W0.8-P0.35-LS1.0-BR
  rect 0.3x0.2 smd: 1(0.5,-0.35) 2(0.5,0.35) 3(-0.5,0)
SOT-23_L2.9-W1.3-P1.90-LS2.4-BR
  rect 1x0.8 smd: 1(1.15,-0.95) 2(1.15,0.95) 3(-1.15,0)
SOT-25-5_L2.9-W1.6-P0.95-LS2.8-BL
  rect 0.623x1.105 smd: 1(-0.95,-1.3) 2(-0.001,-1.3) 3(0.95,-1.3) 4(0.95,1.3) 5(-0.95,1.3)
TSOT-23-5_L2.9-W1.6-P0.95-LS2.8-BR
  rect 1.1x0.7 smd: 1(1.294,-0.951) 2(1.294,-0.001) 3(1.294,0.951) 4(-1.294,0.951) 5(-1.294,-0.949)
USB-C-SMD_TYPE-C-16P-1
  rect 0.6x1.15 smd: A1B12(-3.2,2.41) A4B9(-2.4,2.41) B1A12(3.2,2.41) B4A9(2.4,2.41)
  rect 0.3x1.15 smd: A5(-1.25,2.41) A6(-0.25,2.41) A7(0.25,2.41) A8(1.25,2.41) B5(1.75,2.41) B6(0.75,2.41) B7(-0.75,2.41) B8(-1.75,2.41)
  oval 1x2.1 hole 0.6x1.7: EP(-4.32,1.74) EP(4.32,1.74)
  oval 1x1.8 hole 0.6x1.4: EP(-4.32,-2.41) EP(4.32,-2.41)

## Nets
As in the schematic, except:
P0.17: CN3.3 U10.21
P0.20: H2.5 U10.47
P0.22: H2.6 U10.46
P0.24: H2.7 U10.45

Pads without a net: CN1 4; SW2 2 3; U5 4; U6 7 8; U10 7 8 11 12 13 20 23 25 26 27 28 29 30 32 33 34 35 36 40 51 52 54 60 61 62 63; USB1 A8 B8

## Via types
v1: diameter 0.406, hole 0.203, Top Layer to Bottom Layer, 49 vias
v2: diameter 0.399, hole 0.201, Top Layer to Bottom Layer, 11 vias
v3: diameter 0.61, hole 0.305, Top Layer to Bottom Layer, 6 vias
v4: diameter 0.508, hole 0.254, Top Layer to Bottom Layer, 3 vias
v5: diameter 0.762, hole 0.432, Top Layer to Bottom Layer, 1 via

## Routing (per net, layer and track width the routed paths; a pad name or vN(x,y) marks a point on that pad's centre or on a via; arc(x,y) is an arc through that point)
GND: length 40.7
  Top Layer w0.254: C28.1 20.73,18.88 ; U10.59 U10.57 U10.56 ; 6.43,12.21 5.82,12.21 ; 15.09,19.42 16.2,19.42 16.23,19.4 C51.2 ; 15.09,19.42 15.06,19.45 C38.1 ; 15.09,19.42 15.32,19.19 v1(15.32,18.64) 15.32,17.82 ; v1(9.04,9.61) 9.21,9.61 R1.1 ; H1.7 1.75,31.94 C47.2 ; C27.2 v1(7.11,18.5) ; R6.1 4.95,2.83 ; U9.7 16.84,14.88 v1(15.85,14.88) ; C50.1 C49.1 v1(9.22,14.67) ; 6.55,12.21 6.58,12.23 8.45,12.23 9.12,12.9 ; 3.74,18.53 v1(2.95,18.53) ; R2.2 16.01,9.4 C17.1 17.33,9.38 17.41,9.46
  Top Layer w0.33: C51.2 18.41,19.4 C60.2
  Top Layer w0.508: 20.24,4.43 v1(20.24,5.19)
  Top Layer w0.635: USB1.A1B12 8.93,6.17 USB1.EP ; USB1.B1A12 16.45,6.84 USB1.EP
  Bottom Layer w0.254: 12.95,21.95 U6.2 U6.3 12.45,20.44 C29.2 12.37,20.35 12.37,19.77 11.66,19.77 11.25,20.18 11.25,20.99 11.05,21.2 10.7,21.2 C30.2 ; 12.95,21.95 U6.12 ; 12.95,21.95 U6.9
  vias: v1(2.95,17.59) v1(4.95,13.48) v1(5.64,13.47) v1(6.21,5.4) v1(10.34,9.94) v1(11.79,9.33) v1(13,10.02) v1(13.08,19.85) v1(14.05,12.94) v1(14.35,9.99) v1(15.29,15.46) v1(15.47,9.97) v1(15.86,14.24) v1(16.71,9.94) v1(16.92,17.44) v1(18.39,8.5) v1(20.9,27.24) v1(20.88,26.4) v3(2.11,34.28) v3(2.11,3.8) v3(22.43,34.28) v3(24.54,15.76)
VBUS: length 58.8
  Top Layer w0.254: 15.2,7.77 15.2,8.03 14.94,8.29 14.94,8.83 ; 14.94,8.83 C1.2 ; 14.94,8.83 C17.2 ; C38.2 14.02,20.18 14.38,20.54 16.51,20.54 v4(17.03,21.05) 17.91,21.93 17.91,22.67 U10.55 ; USB1.B4A9 15.2,7.44 ; D2.2 6.36,3.96 R6.2 ; 21.19,7.02 22.15,6.07 22.15,3.42 21.51,2.78 20.36,2.78 R3.2
  Top Layer w0.33: USB1.B4A9 15.2,6.3 14.02,5.12 14.02,5.02 ; 10.46,6.78 10.46,6.23 11.48,5.22 11.48,5.02
  Top Layer w0.381: 14.02,5.02 11.48,5.02 ; 10.46,6.78 USB1.A4B9
  Top Layer w0.508: 15.2,7.44 15.2,7.77 15.54,8.11 17.6,8.11 18.16,7.56 18.16,6.39 18.59,5.96 20.97,5.96 21.19,6.18 21.19,7.02 20.02,8.19 v4(19.99,8.19) ; 10.69,4.22 11.48,5.02
  Top Layer w0.635: Q1.1 4.73,7 4.73,5.59 D2.2 10.69,4.22
  Bottom Layer w0.508: v4(19.99,8.19) 19.99,18.09 v4(17.03,21.05)
VDD: length 22.6
  Top Layer w0.305: C24.2 6.48,12.81 7.72,12.81 v4(7.72,13.57) 7.72,14.39 7.52,14.59 5.88,14.59
  Top Layer w0.635: Q1.2 v5(6.83,7.21) 6.19,6.57 D2.1 ; 5.88,14.59 5.88,15.64 5.68,15.84 4.28,15.84 3.98,15.53 3.98,14.59
  Bottom Layer w0.508: v4(7.72,13.57) 6.83,12.67 v5(6.83,7.21) 6.22,6.6 4.4,6.6 3.39,5.59 CN3.1
VDD_NRF: length 38.5
  Top Layer w0.254: v1(5.1,18.5) 5.1,17.72 4.6,17.21 U5.5 ; v1(5.1,18.5) C27.1 ; v1(5.1,18.5) 4.31,18.5 C26.2 ; C35.2 C46.1 17.3,19.97 C51.1 18.41,19.95 C60.1 18.47,20.76 v1(18.29,20.94) ; 17.96,25.13 18.03,25.13 18.62,24.55 18.62,23.48 19.08,23.02 U10.9 ; 2.69,30.34 2.69,27.51 R16.2 ; 2.69,30.34 2.24,29.89 H1.6 ; 2.69,30.34 3.71,31.36 ; 19.08,19.07 18.8,18.8 18,18.8 17.86,18.66 v1(16.71,18.66) C32.2 15.87,15.65 U9.6 ; U9.8 16.87,13.3 v1(16.71,13.13) 16.51,12.94 R15.2 ; LED2.1 24.67,9.5 v1(24.36,9.18) ; C47.1 3.71,31.36 ; 3.71,31.36 R17.2
  Top Layer w0.33: 19.05,19.52 19.06,19.51 R8.2
  Top Layer w0.381: 19.08,19.07 19.05,19.1 19.05,20.66 19.71,21.32 U10.9
  Bottom Layer w0.254: v1(9.5,21.4) 9.68,21.4 10.06,21.78 C30.1 11.22,21.78 11.4,21.95 U6.5 U6.6 11.4,22.45 11.09,22.76 R14.2
AIN0: length 40.4
  Top Layer w0.254: v2(3.99,13.58) 3.99,12.75 4.06,12.67 4.11,12.72 5.26,12.72 ; 5.64,26.28 6.45,26.28 v1(6.81,26.63) ; 5.64,26.28 U10.5 ; 5.64,26.28 v2(4.01,26.28)
  Bottom Layer w0.254: v2(4.01,26.28) 4.47,25.82 4.47,14.05 v2(3.99,13.58) ; H2.2 24.11,20.13 22.5,21.73 22.5,22.28 17.95,26.83 11.46,26.83 10.46,27.83 7.26,27.83 6.81,27.37 v1(6.81,26.63)
AIN1: length 22.1
  Top Layer w0.254: U10.6 5.66,25.26 v2(3.76,25.26)
  Bottom Layer w0.254: v2(3.76,25.26) 3.94,25.08 3.94,15.81 1.55,13.42 1.55,7.4 2.11,6.84 CN3.2
AIN2: length 16.3
  Top Layer w0.254: v1(11.23,28.13) 10.62,28.74 U10.18
  Bottom Layer w0.254: v1(11.23,28.13) 11.79,27.57 18.81,27.57 H2.3
AIN4: length 19.9
  Top Layer w0.254: v1(14.3,23.43) 14.17,23.43 U10.37
  Bottom Layer w0.254: v1(14.3,23.43) 13.56,24.17 13.56,25.74 14.07,26.25 14.07,26.28 14.12,26.33 17.63,26.33 21.87,22.08 21.87,19.99 24.11,17.75 H2.1
AIN5: length 10.8
  Top Layer w0.254: v1(15.6,28.16) 15.54,28.16 U10.39
  Bottom Layer w0.254: v1(15.6,28.16) 20.77,28.16 H2.4
BAT+: length 26.1
  Top Layer w0.254: Q1.3 5.26,11.63 R4.2
  Top Layer w0.508: v3(21.26,3.47) 21.26,4.37 21.19,4.43
  Top Layer w0.635: C16.2 9.22,11.29 9.15,11.21 v3(8.15,11.21) 6.95,11.21 6.63,10.89 Q1.3
  Bottom Layer w0.508: v3(21.26,3.47) 12.52,3.47 11.98,4.01 CN1.2 11.36,5.7 8.15,8.91 v3(8.15,11.21)
BLUE: length 19.5
  Top Layer w0.254: R9.1 v1(23.84,12.31) ; v1(15.67,25.62) U10.41
  Bottom Layer w0.254: v1(15.67,25.62) 17.4,25.62 21.11,21.91 21.11,20 22.12,18.99 22.12,14.02 v1(23.84,12.31)
D+: length 25.9
  Top Layer w0.254: 12.58,7.93 12.58,9.37 D3.1 12.14,9.91 11.12,10.92 11.12,19.77 12.32,20.97 15.77,20.97 17.2,22.39 17.2,24.4 16.46,25.13 ; 12.58,7.93 12.55,7.9 12.55,6.86 ; 12.58,7.93 12.73,8.08 13.4,8.08 13.55,7.92 13.55,6.86
D-: length 25.9
  Top Layer w0.254: USB1.A7 13.05,5.8 12.88,5.63 12.2,5.63 12.05,5.78 USB1.B7 12.05,7.89 11.67,8.27 11.1,8.27 10.85,8.52 10.85,9.42 11.23,9.81 D3.2 11.44,9.94 10.67,10.71 10.67,20.03 12.14,21.5 14.94,21.5 15.77,22.34 15.77,23.25 U10.50
GREEN: length 18.2
  Top Layer w0.254: 14.96,25.13 15.57,24.52 v1(15.57,24.5) ; R10.1 v1(21.36,11.39)
  Bottom Layer w0.254: v1(21.36,11.39) 21.36,19.01 20.32,20.05 20.32,21.4 17.22,24.5 v1(15.57,24.5)
P0.17: length 23.8
  Top Layer w0.254: 10.46,25.13 9.88,25.72 v2(7.06,25.72)
  Bottom Layer w0.254: v2(7.06,25.72) 6.17,24.83 6.17,10.58 4.45,8.85 4.09,8.85 3.33,8.09 CN3.3
P0.20: length 9.1
  Top Layer w0.254: 18.19,29.22 v1(18.19,29.15) 18.08,29.15 U10.47
  Bottom Layer w0.254: v1(18.19,29.15) 22.31,29.15 H2.5
P0.22: length 8.2
  Top Layer w0.254: v1(18.06,29.96) 16.84,28.74 U10.46
  Bottom Layer w0.254: H2.6 24.04,29.96 v1(18.06,29.96)
P0.24: length 8.7
  Top Layer w0.254: U10.45 17.04,29.88 v1(17.98,30.82)
  Bottom Layer w0.254: H2.7 22.5,30.82 v1(17.98,30.82)
READ_BAT: length 27.4
  Top Layer w0.254: v1(9.75,19.93) 10.13,19.55 10.13,10.73 9.65,10.25 8.71,10.25 7.62,9.16 4.85,9.16 4.06,9.94 R7.2 ; v1(9.73,26.91) 10.34,27.52 U10.19
  Bottom Layer w0.254: v1(9.73,26.91) 8.89,26.07 8.89,20.79 v1(9.75,19.93)
RED: length 20
  Top Layer w0.254: R11.1 22.11,10.1 v1(21.36,10.1) ; v1(14.27,24.42) 14.76,23.94 U10.43
  Bottom Layer w0.254: v1(14.27,24.42) 15.06,23.63 16.92,23.63 19.53,21.02 19.53,19.93 20.75,18.71 20.75,10.71 v1(21.36,10.1)
RESET: length 17.5
  Top Layer w0.254: SW2.1 21.08,14.58 21.41,14.91 21.41,20.02 ; U10.14 21.06,28.54 21.41,28.18 21.41,20.02 ; 21.41,20.02 C28.2 20.69,19.99 R8.1
RXD: length 12.9
  Top Layer w0.254: H1.2 1.86,19.73 3.02,20.89 9.85,20.89 11.05,22.08 11.05,23.36 U10.22
SCK1: length 8.6
  Top Layer w0.254: U10.66 8.97,22.36 8.39,21.78 3.86,21.78 v2(3.25,22.39)
  Bottom Layer w0.254: v2(3.25,22.39) 1.36,22.39 H1.3
SCL: length 25
  Top Layer w0.254: U9.4 13.69,16.83 13.69,18.6 v1(13.69,18.61) ; R16.1 3.68,28.16 5.16,29.63 U10.2 6.6,29.63 7.47,28.77 7.47,26.83 8,26.3 v2(8.28,26.3)
  Bottom Layer w0.254: U6.1 13.69,21.08 v1(13.69,18.61) 13.08,19.21 9.55,19.21 8.28,20.48 v2(8.28,26.3)
SDA: length 31.3
  Top Layer w0.254: U9.3 14.45,15.65 14.91,16.12 14.91,16.85 14.35,17.41 v1(14.35,17.87) ; v2(8.15,27.06) 8.15,29.15 6.58,30.72 U10.1 4.5,30.72 4.39,30.62 4.39,29.77 4.14,29.51 3.75,29.51
  Bottom Layer w0.254: v2(8.15,27.06) 8.13,27.09 7.82,27.09 7.47,26.73 7.47,26.2 7.82,25.84 7.82,20.18 9.37,18.63 12.8,18.63 13.56,17.87 v1(14.35,17.87) 14.35,22.11 14.01,22.45 U6.11
SDA1: length 15
  Top Layer w0.254: H1.4 2.08,24.81 2.52,24.38 2.52,21.65 2.87,21.3 8.51,21.3 9.73,22.52 9.73,24.14 8.97,24.9 8.97,25.13
SDO1: length 12.4
  Top Layer w0.254: U10.65 8.33,23.94 8.15,23.76 8.15,22.44 7.92,22.21 4.55,22.21 3.03,23.73 3.03,25.56 1.25,27.34 H1.5
SWDCLK: length 28.6
  Top Layer w0.254: U10.15 21.69,29.63 21.95,29.37 21.95,12.66 20.6,12.66 20.35,12.41 20.35,9.07 21.28,8.14 21.64,8.14 23.03,6.74 H3.3
SWDIO: length 30.8
  Top Layer w0.254: v1(21.69,8.93) 20.8,9.82 20.8,11.92 21.06,12.18 22.5,12.18 22.5,29.91 21.69,30.72 U10.16
  Bottom Layer w0.254: v1(21.69,8.93) 23.15,7.47 23.15,5.68 23.35,5.47 H3.2
TXD: length 16.5
  Top Layer w0.254: H1.1 1.25,17.96 3.77,20.48 10.27,20.48 11.77,21.99 13.75,21.99 14.48,22.72 U10.44
$1N6010: length 3.4
  Top Layer w0.254: USB1.A5 11.55,7.53 11.27,7.81 9.85,7.81 9.7,7.96 9.7,8.58 R1.2
$1N6013: length 2.4
  Top Layer w0.254: USB1.B5 14.55,7.74 13.74,8.55 R2.1
$1N6476: length 3.3
  Top Layer w0.254: R5.2 18.54,9.41 19.29,8.66 U3.5
$1N7177: length 3.7
  Bottom Layer w0.254: R14.1 10.67,23.41 11.1,23.84 13.13,23.84 13.45,23.52 U6.10
$1N7737: length 1.1
  Bottom Layer w0.254: U6.4 11.79,21.17 11.79,20.3
$1N8157: length 2.9
  Top Layer w0.254: R15.1 15.23,14.61 14.99,14.85 U9.2
$1N9194: length 1.2
  Top Layer w0.254: LED2.4 24.65,10.47 24.65,11.09 24.32,11.42 R9.2
$1N9197: length 1.4
  Top Layer w0.254: LED2.3 23.61,10.45 R10.2
$1N9200: length 1.2
  Top Layer w0.254: R11.2 22.79,10.12 23.12,9.8 LED2.2
$1N15220: length 1.5
  Top Layer w0.254: R3.1 19.54,3.06 19.54,2.72 20.32,1.94
$1N15223: length 3.7
  Top Layer w0.508: 19.29,4.43 18.89,4.43 18.49,4.04 18.49,2.22 18.84,1.87 LED1.1
$1N50577: length 17.2
  Top Layer w0.254: 9.08,18.39 9.08,19.67 8.78,19.98 v2(5.64,19.98) ; U10.3 4.85,28.54 v2(4.47,28.16) ; X4.2 9.11,16.17 C49.2
  Bottom Layer w0.254: v2(4.47,28.16) 5.03,28.16 5.49,27.7 5.49,20.13 v2(5.64,19.98)
$1N50578: length 15.4
  Top Layer w0.254: U10.4 4.7,27.44 v2(4.65,27.39) ; C50.2 7.95,16.09 7.95,19.19 7.77,19.37 v2(5,19.37)
  Bottom Layer w0.254: v2(4.65,27.39) 4.98,27.06 4.98,19.39 v2(5,19.37)

## Copper pours and planes (outline as drawn; the poured copper is in the pictures)
GND on Top Layer: -9.55,44.64 32.74,44.64 32.74,-6.36 -9.55,-6.36
GND on Bottom Layer: -6.64,42.25 30.82,42.25 30.82,-4.36 -6.64,-4.36
GND on Inner1: -2.96,39.62 26.96,39.62 26.96,-2.04 -2.96,-2.04
VDD_NRF on Inner2: -4.92,40.96 29.4,40.96 29.4,-3.13 -4.92,-3.13

## Text on the board
Bottom Silkscreen Layer: + -
